# EAGLE design dlphat (EAGLE 7.7.0)
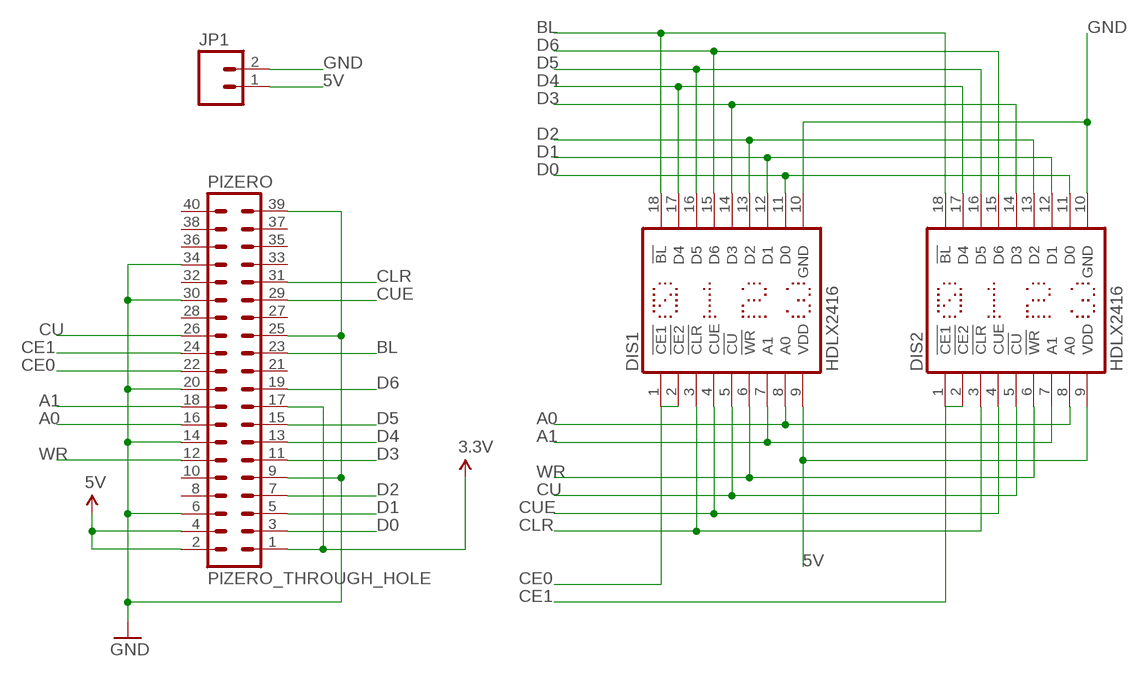
[diagram p0: schematic, sheet 1]

## Parts
DIS1  HDLX2416  [HDLX2416]
DIS2  HDLX2416  [HDLX2416]
JP1  M02POLAR  [MOLEX-1X2]
PIZERO  PIZERO_THROUGH_HOLE  [PIZERO_THOUGH_HOLE]

## Nets
3.3V: PIZERO.1 PIZERO.17
5V: DIS1.9(VDD) DIS2.9(VDD) JP1.1 PIZERO.2 PIZERO.4
A0: DIS1.8(A0) DIS2.8(A0) PIZERO.16
A1: DIS1.7(A1) DIS2.7(A1) PIZERO.18
BL: DIS1.18(!BL) DIS2.18(!BL) PIZERO.23
CE0: DIS1.1(!CE1) DIS1.2(!CE2) PIZERO.22
CE1: DIS2.1(!CE1) DIS2.2(!CE2) PIZERO.24
CLR: DIS1.3(!CLR) DIS2.3(!CLR) PIZERO.31
CU: DIS1.5(!CU) DIS2.5(!CU) PIZERO.26
CUE: DIS1.4(CUE) DIS2.4(CUE) PIZERO.29
D0: DIS1.11(D0) DIS2.11(D0) PIZERO.3
D1: DIS1.12(D1) DIS2.12(D1) PIZERO.5
D2: DIS1.13(D2) DIS2.13(D2) PIZERO.7
D3: DIS1.14(D3) DIS2.14(D3) PIZERO.11
D4: DIS1.17(D4) DIS2.17(D4) PIZERO.13
D5: DIS1.16(D5) DIS2.16(D5) PIZERO.15
D6: DIS1.15(D6) DIS2.15(D6) PIZERO.19
GND: DIS1.10(GND) DIS2.10(GND) JP1.2 PIZERO.6 PIZERO.9 PIZERO.14 PIZERO.20 PIZERO.25 PIZERO.30 PIZERO.34 PIZERO.39
WR: DIS1.6(!WR) DIS2.6(!WR) PIZERO.12
Unconnected: PIZERO.8 PIZERO.10 PIZERO.21 PIZERO.27 PIZERO.28 PIZERO.32 PIZERO.33 PIZERO.35 PIZERO.36 PIZERO.37 PIZERO.38 PIZERO.40

## Library data of the parts
DIS1 DIS2 = display-hp:HDLX2416: LED DISPLAY 4-character dot matrix; OC_FARNELL: unknown; OC_NEWARK: unknown
JP1 = SparkFun-Connectors:M02: Standard 2-pin 0.1" header. Use with - straight break away headers ( PRT-00116) - right angle break away headers (PRT-00553) - swiss pins (PRT-00743) - machine pins (PRT-00117) - female headers (PRT-00115) Molex polarized connector foot print use with: PRT-08233 with associated crimp pins and housings. 2.54_SCREWTERM for use with PRT-10571. 3.5mm Screw Terminal footprints for PRT-08084 5mm Screw Terminal footprints for use with PRT-08432
PIZERO = pizero:PIZERO_THROUGH_HOLE

## Board
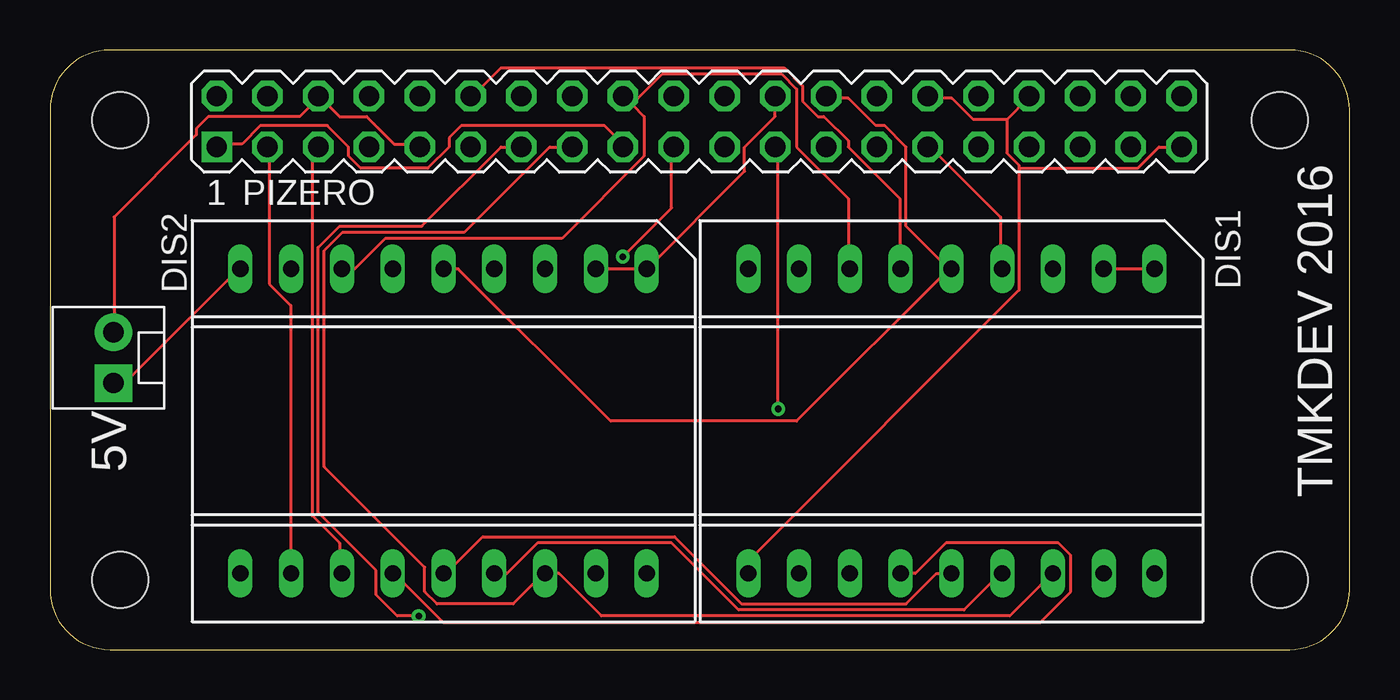
[diagram p1: board, top side]
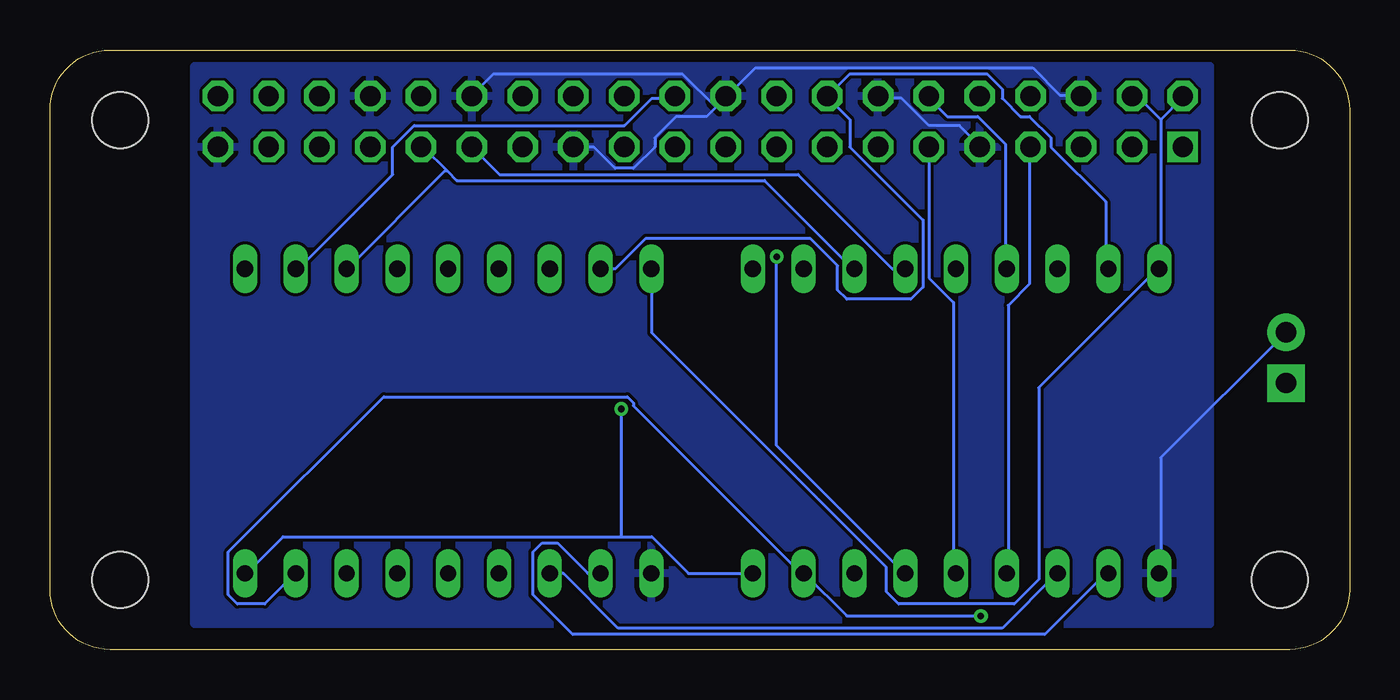
[diagram p2: board, bottom side, seen from below]

Size 65 x 30 mm. Coordinates in mm from the lower left corner, seen from the top.
Copper layers (1*16): Top 0.0356mm / dielectric 1.5011mm / Bottom 0.0356mm
Design rules "LaenPCBOrder": minimum track width 6mil, minimum drill 13mil, track to track 6mil, track to pad 6mil, pad to pad 6mil, via to via 6mil, smd to smd 6mil, copper to edge 15mil, drill to drill 6mil, minimum pad ring 7mil, minimum via ring 7mil, stop-mask expansion 3mil, vias tented up to drill 0mil, thermal gap 10mil

### Footprints (pad centres in the part's own frame; a part is rotated, then mirrored left to right if it is on the bottom)
HDLX2416 = drill 0.813 long: 1 -10.16,-7.62; 2 -7.62,-7.62; 3 -5.08,-7.62; 4 -2.54,-7.62; 5 0,-7.62; 6 2.54,-7.62; 7 5.08,-7.62; 8 7.62,-7.62; 9 10.16,-7.62; 10 10.16,7.62; 11 7.62,7.62; 12 5.08,7.62; 13 2.54,7.62; 14 0,7.62; 15 -2.54,7.62; 16 -5.08,7.62; 17 -7.62,7.62; 18 -10.16,7.62
MOLEX-1X2 = drill 1.016 pad 1.88 square: 1 0,0 | drill 1.016 pad 1.88: 2 2.54,0
PIZERO_THOUGH_HOLE = drill 1.016 square: 1 8.34,25.15 | drill 1.016 octagon: 2 8.34,27.69; 3 10.88,25.15; 4 10.88,27.69; 5 13.42,25.15; 6 13.42,27.69; 7 15.96,25.15; 8 15.96,27.69; 9 18.5,25.15; 10 18.5,27.69; 11 21.04,25.15; 12 21.04,27.69; 13 23.58,25.15; 14 23.58,27.69; 15 26.12,25.15; 16 26.12,27.69; 17 28.66,25.15; 18 28.66,27.69; 19 31.2,25.15; 20 31.2,27.69; 21 33.74,25.15; 22 33.74,27.69; 23 36.28,25.15; 24 36.28,27.69; 25 38.82,25.15; 26 38.82,27.69; 27 41.36,25.15; 28 41.36,27.69; 29 43.9,25.15; 30 43.9,27.69; 31 46.44,25.15; 32 46.44,27.69; 33 48.98,25.15; 34 48.98,27.69; 35 51.52,25.15; 36 51.52,27.69; 37 54.06,25.15; 38 54.06,27.69; 39 56.6,25.15; 40 56.6,27.69 | hole 2.8: 3.5,3.5; 3.5,26.5; 61.5,26.5; 61.5,3.5

### Placement (x,y rotation side)
DIS1  45.09,11.43 180 top
DIS2  19.68,11.43 180 top
JP1  3.17,13.34 90 top
PIZERO  0,0 0 top

### Tracks (layer width: path | path; a pad name or v marks a point on that pad's centre or on a via)
3.3V
  Top 0.152: PIZERO.1 8.38,25.3 9.6,25.3 10.52,26.21 13.87,26.21 14.94,25.15 14.94,24.69 15.54,24.08 18.9,24.08 19.96,25.15 19.96,25.6 20.57,26.21 27.74,26.21 28.65,25.3 PIZERO.17
5V
  Top 0.152: JP1.1 3.2,13.41 3.81,13.41 9.45,19.05 DIS2.9
  Bottom 0.152: 9.45,26.52 9.45,19.05 DIS2.9 9.6,19.05 15.54,13.11 15.54,3.5 16.76,2.29 22.55,2.29 23.16,2.9 23.16,4.12 34.9,15.85 34.9,19.05 DIS1.9 | 9.45,26.52 8.38,27.58 PIZERO.2 | 9.45,26.52 10.52,27.58 10.82,27.58 PIZERO.4
A0
  Bottom 0.152: DIS2.8 12.19,19.05 12.19,22.4 14.94,25.15 14.94,25.6 16,26.67 16.46,26.67 17.37,27.58 17.37,28.04 18.14,28.8 24.99,28.8 26.06,27.74 PIZERO.16 26.06,27.58 24.99,26.52 24.99,25.15 21.34,21.49 21.34,18.14 21.95,17.53 25.15,17.53 25.6,17.98 25.6,19.2 26.98,20.57 35.2,20.57 36.73,19.05 DIS1.8
A1
  Top 0.152: DIS2.7 15.24,19.05 16.76,20.57 25.6,20.57 29.72,24.69 29.72,26.67 29.11,27.28 | 29.11,27.28 28.8,27.58 PIZERO.18 29.11,27.28 | 29.11,27.28 30.63,28.8 36.58,28.8 37.34,28.04 37.34,25.15 39.93,22.55 39.93,19.05 DIS1.7
BL  (via drill 0.33)
  Top 0.152: v36.42,12.04 36.42,25.15 PIZERO.23
  Bottom 0.152: DIS2.18 33.07,3.81 34.9,5.64 36.42,5.64 | 36.42,5.64 53.34,5.64 55.17,3.81 DIS1.18 | 36.42,5.64 v36.42,12.04
CE0
  Top 0.152: DIS1.1 DIS1.2
  Bottom 0.152: PIZERO.22 33.83,27.58 34.9,27.58 36.27,26.21 46.79,26.21 47.85,25.15 47.85,23.77 52.58,19.05 DIS1.2
CE1
  Top 0.152: DIS2.2 DIS2.1 29.87,19.05 34.75,23.93 34.75,25.15 36.27,26.67 36.27,27.58 PIZERO.24
CLR
  Bottom 0.152: 45.11,23.93 46.33,25.15 PIZERO.31 | 45.11,23.93 44.65,23.47 29.26,23.47 24.84,19.05 DIS2.3 | 45.11,23.93 45.26,23.93 50.14,19.05 DIS1.3
CU
  Top 0.152: DIS2.5 20.42,19.05 28.04,11.43 37.34,11.43 44.96,19.05 | 44.96,19.05 42.82,21.18 42.82,25.15 41.76,26.21 41.3,26.21 39.93,27.58 38.86,27.58 PIZERO.26 | 44.96,19.05 DIS1.5
CUE
  Top 0.152: DIS1.4 47.55,19.05 47.55,21.64 44.04,25.15 PIZERO.29
  Bottom 0.152: DIS2.4 22.86,19.05 27.58,23.77 42.52,23.77 PIZERO.29
D0
  Top 0.152: DIS2.11 12.04,3.81 12.04,17.22 10.97,18.29 10.97,25.15 PIZERO.3
  Bottom 0.152: DIS1.11 38.1,3.81 39.62,5.33 40.39,5.33 40.84,4.88 40.84,2.74 38.86,0.76 15.24,0.76 12.19,3.81 DIS2.11
D1
  Top 0.152: DIS2.12 14.48,3.81 14.48,5.33 13.11,6.71 13.11,24.84 PIZERO.5
  Bottom 0.152: DIS1.12 39.32,3.81 36.58,1.07 17.37,1.07 14.63,3.81 DIS2.12
D2
  Top 0.152: DIS1.13 43.28,3.81 44.81,5.33 50.44,5.33 51.05,4.72 51.05,2.9 49.53,1.37 19.66,1.37 17.22,3.81 DIS2.13
  Bottom 0.152: DIS2.13 17.07,3.81 17.07,17.22 16,18.29 16,25.15 PIZERO.7
D3
  Top 0.152: DIS1.14 44.35,3.81 42.82,2.29 34.59,2.29 31.24,5.64 21.64,5.64 19.81,3.81 DIS2.14
  Bottom 0.152: DIS2.14 19.81,3.81 19.81,17.37 21.03,18.59 PIZERO.11
D4  (via drill 0.33)
  Top 0.152: v18.44,1.68 17.37,1.68 16.31,2.74 16.31,3.96 13.41,6.86 13.41,20.12 14.48,21.18 18.59,21.18 22.55,25.15 23.47,25.15 PIZERO.13
  Bottom 0.152: DIS1.17 52.73,3.81 54.25,2.29 55.63,2.29 56.08,2.74 56.08,4.88 48.31,12.65 36.12,12.65 35.81,12.34 35.81,12.19 27.43,3.81 DIS2.17 27.28,3.81 25.15,1.68 v18.44,1.68
D5
  Top 0.152: DIS1.16 50.14,3.81 48.01,1.68 27.58,1.68 25.45,3.81 DIS2.16 24.69,3.81 23.16,2.29 19.36,2.29 18.75,2.9 18.75,4.12 13.72,9.14 13.72,19.96 14.63,20.88 20.73,20.88 24.99,25.15 26.06,25.15 PIZERO.15
D6  (via drill 0.33)
  Top 0.152: DIS2.15 22.86,3.81 24.38,5.33 31.09,5.33 34.44,1.98 45.72,1.98 47.55,3.81 DIS1.15 | v28.65,19.66 31.09,22.1 31.09,25.15 PIZERO.19
  Bottom 0.152: v28.65,19.66 28.65,10.21 22.25,3.81 DIS2.15
GND
  Top 0.152: PIZERO.9 18.44,25.3 17.22,25.3 15.85,26.67 14.48,26.67 13.56,27.58 PIZERO.6 13.41,27.58 12.5,26.67 7.92,26.67 7.32,26.06 7.32,25.76 3.2,21.64 3.2,16 JP1.2 | 48.46,24.08 48.46,24.23 47.85,24.84 47.85,26.52 | 48.46,24.08 48.46,17.98 35.05,4.57 35.05,3.81 DIS1.10 | 47.85,26.52 48.92,27.58 PIZERO.34 | 47.85,26.52 46.18,26.52 45.11,27.58 44.04,27.58 PIZERO.30 | 48.46,24.08 54.41,24.08 55.47,25.15 56.54,25.15 PIZERO.39
  Bottom 0.152: JP1.2 9.45,9.6 9.45,3.81 DIS2.10 | PIZERO.14 23.47,27.58 22.4,27.58 21.03,26.21 19.51,26.21 18.59,25.3 PIZERO.9 | 31.7,27.13 31.24,27.58 PIZERO.20 | 31.7,27.13 32.16,26.67 33.68,26.67 34.75,25.6 34.75,25.15 35.81,24.08 36.73,24.08 37.8,25.15 38.71,25.15 PIZERO.25 | 31.7,27.13 33.38,28.8 42.82,28.8 43.89,27.74 PIZERO.30 | 31.7,27.13 PIZERO.20 | PIZERO.6 13.56,27.74 14.48,27.74 15.85,29.11 29.72,29.11 31.09,27.74 PIZERO.20
  pour Bottom: 6.99,29.21 6.99,1.27 57.78,1.27 57.78,29.21
WR
  Top 0.152: DIS1.6 42.52,19.05 42.52,22.55 39.93,25.15 39.93,25.45 38.71,26.67 38.41,26.67 37.64,27.43 37.64,28.19 36.73,29.11 22.55,29.11 21.18,27.74 PIZERO.12
  Bottom 0.152: DIS2.6 17.22,19.05 17.22,25.3 18.59,26.67 20.12,26.67 21.03,27.58 PIZERO.12

### Text on the board
tNames: 5V | TMKDEV 2016